# Altium schematic sheet Fusion.SchDoc
size A2
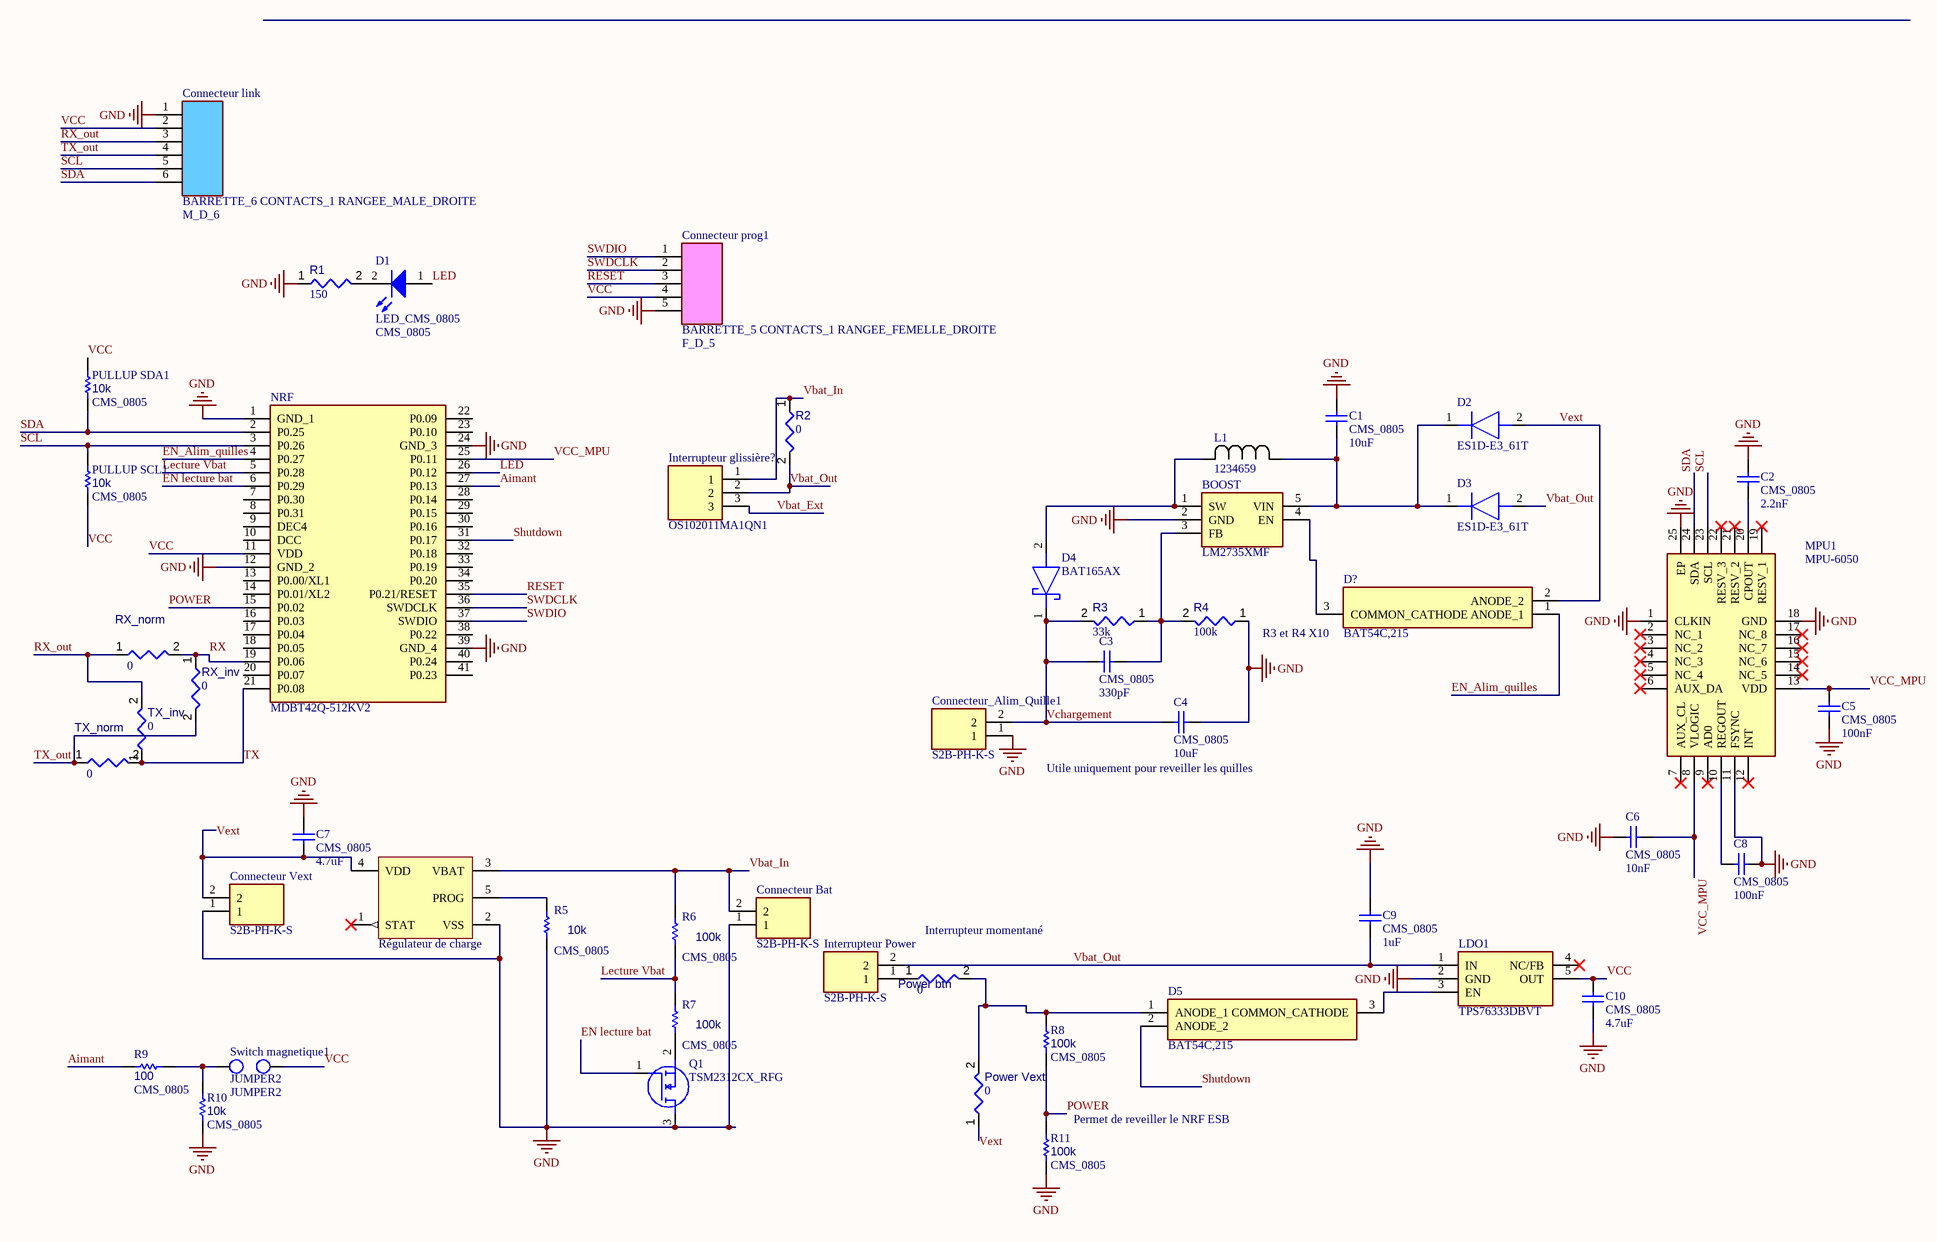
[diagram p0: Fusion.SchDoc]

## Parts
BOOST  LM2735XMF  [SOT95P285X110-5N]
C1  value 10uF  Type: CMS_0805  [CONDENSATEUR_CMS_0805]  (hidden comment: CONDENSATEUR_CMS_CER_0805)
C2  value 2.2nF  Type: CMS_0805  [CONDENSATEUR_CMS_0805]  (hidden comment: CONDENSATEUR_CMS_CER_0805)
C3  value 330pF  Type: CMS_0805  [CONDENSATEUR_CMS_0805]  (hidden comment: CONDENSATEUR_CMS_CER_0805)
C4  value 10uF  Type: CMS_0805  [CONDENSATEUR_CMS_0805]  (hidden comment: CONDENSATEUR_CMS_CER_0805)
C5  value 100nF  Type: CMS_0805  [CONDENSATEUR_CMS_0805]  (hidden comment: CONDENSATEUR_CMS_CER_0805)
C6  value 10nF  Type: CMS_0805  [CONDENSATEUR_CMS_0805]  (hidden comment: CONDENSATEUR_CMS_CER_0805)
C7  value 4.7uF  Type: CMS_0805  [CONDENSATEUR_CMS_0805]  (hidden comment: CONDENSATEUR_CMS_CER_0805)
C8  value 100nF  Type: CMS_0805  [CONDENSATEUR_CMS_0805]  (hidden comment: CONDENSATEUR_CMS_CER_0805)
C9  value 1uF  Type: CMS_0805  [CONDENSATEUR_CMS_0805]  (hidden comment: CONDENSATEUR_CMS_CER_0805)
C10  value 4.7uF  Type: CMS_0805  [CONDENSATEUR_CMS_0805]  (hidden comment: CONDENSATEUR_CMS_CER_0805)
Connecteur_Alim_Quille1  S2B-PH-K-S  [S2BPHKS]
Connecteur_Bat  S2B-PH-K-S  [S2BPHKS]
Connecteur_link  BARRETTE_6 CONTACTS_1 RANGEE_MALE_DROITE  Type: M_D_6  [BARRETTE_6_M_D]
Connecteur_prog1  BARRETTE_5 CONTACTS_1 RANGEE_FEMELLE_DROITE  Type: F_D_5  [BARRETTE_5_F_D]
Connecteur_Vext  S2B-PH-K-S  [S2BPHKS]
D1  LED_CMS_0805  Type: CMS_0805  [LED_CMS_0805]
D2  ES1D-E3_61T  [DIOM5127X229N]
D3  ES1D-E3_61T  [DIOM5127X229N]
D4  BAT165AX  [BAT165AX]
D5  BAT54C,215  [BAT54C215]
D?  BAT54C,215  [BAT54C215]
Interrupteur_glissière?  OS102011MA1QN1  [OS102011MA1QN1]
Interrupteur_Power  S2B-PH-K-S  [S2BPHKS]
L1  1234659  [IND_123_4659_RSP]
LDO1  TPS76333DBVT  [SOT95P280X145-5N]
MPU1  MPU-6050  [MPU6050]
NRF  MDBT42Q-512KV2  [MDBT42Q512KV2]
Power_btn  value 0  [RESC1608X55X25ML10T15]  (hidden comment: Resistor 4k7 +/-1% 0603 100 mW)
Power_Vext  value 0  [RESC1608X55X25ML10T15]  (hidden comment: Resistor 4k7 +/-1% 0603 100 mW)
PULLUP_SCL1  value 10k  Type: CMS_0805  [RESISTANCE_CMS_0805]  (hidden comment: RESISTANCE_CMS_0805)
PULLUP_SDA1  value 10k  Type: CMS_0805  [RESISTANCE_CMS_0805]  (hidden comment: RESISTANCE_CMS_0805)
Q1  TSM2312CX_RFG  [SOT95P280X130-3N]
R1  value 150  [RESC0805(2012)_L]  (hidden comment: Resistor 1K +/-5% 0805 125 mW)
R2  value 0  [RESC1608X55X25ML10T15]  (hidden comment: Resistor 4k7 +/-1% 0603 100 mW)
R3  value 33k  [RESC2013X50X35ML15T15]  (hidden comment: Resistor 10k +/-1% 0805 125 mW)
R4  value 100k  [RESC2013X50X35ML15T15]  (hidden comment: Resistor 10k +/-1% 0805 125 mW)
R5  value 10k  Type: CMS_0805  [RESISTANCE_CMS_0805]  (hidden comment: RESISTANCE_CMS_0805)
R6  value 100k  Type: CMS_0805  [RESISTANCE_CMS_0805]  (hidden comment: RESISTANCE_CMS_0805)
R7  value 100k  Type: CMS_0805  [RESISTANCE_CMS_0805]  (hidden comment: RESISTANCE_CMS_0805)
R8  value 100k  Type: CMS_0805  [RESISTANCE_CMS_0805]  (hidden comment: RESISTANCE_CMS_0805)
R9  value 100  Type: CMS_0805  [RESISTANCE_CMS_0805]  (hidden comment: RESISTANCE_CMS_0805)
R10  value 10k  Type: CMS_0805  [RESISTANCE_CMS_0805]  (hidden comment: RESISTANCE_CMS_0805)
R11  value 100k  Type: CMS_0805  [RESISTANCE_CMS_0805]  (hidden comment: RESISTANCE_CMS_0805)
RX_inv  value 0  [RESC1608X55X25ML10T15]  (hidden comment: Resistor 4k7 +/-1% 0603 100 mW)
RX_norm  value 0  [RESC1608X55X25ML10T15]  (hidden comment: Resistor 4k7 +/-1% 0603 100 mW)
Régulateur_de_charge  MCP73831T-2DCI/OT  [SOT-23-OT5_N]  (value not drawn)
Switch_magnetique1  JUMPER2  [BARRETTE_2_M_D]
TX_inv  value 0  [RESC1608X55X25ML10T15]  (hidden comment: Resistor 4k7 +/-1% 0603 100 mW)
TX_norm  value 0  [RESC1608X55X25ML10T15]  (hidden comment: Resistor 4k7 +/-1% 0603 100 mW)

## Nets
GND: BOOST.2(GND) C1.2 C2.2 C4.2 C5.1 C6.1 C7.2 C8.2 C9.2 C10.1 Connecteur_Alim_Quille1.1 Connecteur_Bat.1 Connecteur_link.1 Connecteur_prog1.5 Connecteur_Vext.1 LDO1.2(GND) MPU1.1(CLKIN) MPU1.11(FSYNC) MPU1.18(GND) MPU1.25(EP) NRF.1(GND_1) NRF.12(GND_2) NRF.24(GND_3) NRF.39(GND_4) Q1.3(D) R1.1 R4.1 R5.1 R10.2 R11.1 Régulateur_de_charge.2(VSS)
Aimant: NRF.27(P0.13) R9.1
EN lecture bat: NRF.6(P0.29) Q1.1(G)
EN_Alim_quilles: D?.1(ANODE_1) NRF.4(P0.27)
Lecture Vbat: NRF.5(P0.28) R6.1 R7.2
LED: D1.1 NRF.26(P0.12)
POWER: NRF.15(P0.02) R8.1 R11.2
RESET: Connecteur_prog1.3 NRF.35(P0.21/RESET)
RX: NRF.19(P0.06) RX_inv.1 RX_norm.2
RX_out: Connecteur_link.3 RX_norm.1 TX_inv.2
SCL: Connecteur_link.5 MPU1.23(SCL) NRF.3(P0.26) PULLUP_SCL1.2
SDA: Connecteur_link.6 MPU1.24(SDA) NRF.2(P0.25) PULLUP_SDA1.1
Shutdown: D5.2(ANODE_2) NRF.31(P0.17)
SWDCLK: Connecteur_prog1.2 NRF.36(SWDCLK)
SWDIO: Connecteur_prog1.1 NRF.37(SWDIO)
TX: NRF.21(P0.08) TX_inv.1 TX_norm.2
TX_out: Connecteur_link.4 RX_inv.2 TX_norm.1
Vbat_Ext: Interrupteur_glissière?.3
Vbat_In: Connecteur_Bat.2 Interrupteur_glissière?.1 R2.1 R6.2 Régulateur_de_charge.3(VBAT)
Vbat_Out: C9.1 D3.2(A) Interrupteur_glissière?.2 Interrupteur_Power.2 LDO1.1(IN) R2.2
VCC: C10.2 Connecteur_link.2 Connecteur_prog1.4 LDO1.5(OUT) NRF.11(VDD) PULLUP_SCL1.1 PULLUP_SDA1.2 Switch_magnetique1.2
VCC_MPU: C5.2 C6.2 MPU1.8(VLOGIC) MPU1.13(VDD) NRF.25(P0.11)
Vchargement: C3.1 C4.1 Connecteur_Alim_Quille1.2 D4.1(K) R3.2
Vext: C7.1 Connecteur_Vext.2 D2.2(A) D?.2(ANODE_2) Power_Vext.1 Régulateur_de_charge.4(VDD)
NetBOOST_1: BOOST.1(SW) D4.2(A) L1.2
NetBOOST_3: BOOST.3(FB) C3.2 R3.1 R4.2
NetBOOST_4: BOOST.4(EN) D?.3(COMMON_CATHODE)
NetBOOST_5: BOOST.5(VIN) C1.1 D2.1(K) D3.1(K) L1.1
NetC2_1: C2.1 MPU1.20(CPOUT)
NetC8_1: C8.1 MPU1.10(REGOUT)
NetD1_2: D1.2 R1.2
NetD5_1: D5.1(ANODE_1) Power_btn.2 Power_Vext.2 R8.2
NetD5_3: D5.3(COMMON_CATHODE) LDO1.3(EN)
NetInterrupteur_Power_1: Interrupteur_Power.1 Power_btn.1
NetQ1_2: Q1.2(S) R7.1
NetR5_2: R5.2 Régulateur_de_charge.5(PROG)
NetR9_2: R9.2 R10.1 Switch_magnetique1.1

Not connected (* = marked no-connect by the designer): LDO1 4(NC/FB)*; MPU1 2(NC_1)* 3(NC_2)* 4(NC_3)* 5(NC_4)* 6(AUX_DA)* 7(AUX_CL)* 9(AD0)* 12(INT)* 14(NC_5)* 15(NC_6)* 16(NC_7)* 17(NC_8)* 19(RESV_1)* 21(RESV_2)* 22(RESV_3)*; NRF 7(P0.30) 8(P0.31) 9(DEC4) 10(DCC) 13(P0.00/XL1) 14(P0.01/XL2) 16(P0.03) 17(P0.04) 18(P0.05) 20(P0.07) 22(P0.09) 23(P0.10) 28(P0.14) 29(P0.15) 30(P0.16) 32(P0.18) 33(P0.19) 34(P0.20) 38(P0.22) 40(P0.24) 41(P0.23); Régulateur_de_charge 1(STAT)*

## Notes on the sheet
- (near D?) R3 et R4 X10
- (near C4) Utile uniquement pour reveiller les quilles
- Interrupteur momentané
- (near R11) Permet de reveiller le NRF ESB

## Library data of the parts
BOOST = LM2735XMF: Integrated Circuit; Manufacturer_Name: Texas Instruments; Manufacturer_Part_Number: LM2735XMF
C1-C10 = CMP-038-0003-1: CONDENSATEUR CMS CERAMIQUE 0805; Source: composants passifs.SchLib; Design Item ID: CONDENSATEUR_CMS_CER_0805
Connecteur_Alim_Quille1 Connecteur_Bat Connecteur_Vext Interrupteur_Power = S2B-PH-K-S: Connector; Manufacturer_Name: JST (JAPAN SOLDERLESS TERMINALS); Datasheet Link: https://media.digikey.com/pdf/Data%20Sheets/JST%20PDFs/PH%20Series.pdf; Height: 4.8mm; Manufacturer_Part_Number: S2B-PH-K-S
Connecteur_link = CMP-039-0125-1: BARRETTE 6 CONTACTS 1 RANGEE MALE DROITE; Source: connecteurs.SchLib; Design Item ID: BARRETTE_6 CONTACTS_1 RANGEE_MALE_DROITE
Connecteur_prog1 = CMP-039-0118-1: BARRETTE 5 CONTACTS 1 RANGEE FEMELLE DROITE; Design Item ID: BARRETTE_5 CONTACTS_1 RANGEE_FEMELLE_DROITE; Source: connecteurs.SchLib
D1 = CMP-024-0003-1: LED CMS 0805; Source: affichage.SchLib; Design Item ID: LED_CMS_0805
D2 D3 = ES1D-E3_61T: Diode; Manufacturer_Name: Vishay; Manufacturer_Part_Number: ES1D-E3/61T; Datasheet Link: https://componentsearchengine.com/Datasheets/2/ES1D-E3_61T.pdf; Height: 2.29mm; Mouser Part Number: 625-ES1D-E3; Mouser Price/Stock: https://www.mouser.co.uk/ProductDetail/Vishay-General-Semiconductor/ES1D-E3-61T?qs=rfh7uIuiIO0XwaKoN5aNdQ%3D%3D; Arrow Part Number: ES1D-E3/61T; Arrow Price/Stock: https://www.arrow.com/en/products/es1d-e361t/vishay
D4 = BAT165AX: Schottky Diode; Manufacturer_Name: Nexperia; Datasheet Link: https://assets.nexperia.com/documents/data-sheet/BAT165A.pdf; Height: 1.1mm; Manufacturer_Part_Number: BAT165AX; Mouser Part Number: 771-BAT165AX; Mouser Price/Stock: https://www.mouser.co.uk/ProductDetail/Nexperia/BAT165AX?qs=1fQ7IOp4WriMQ9TlJoQ5jw%3D%3D; Arrow Part Number: BAT165AX; Arrow Price/Stock: https://www.arrow.com/en/products/bat165ax/nexperia?region=nac
D5 D? = BAT54C,215: Schottky Diode; Manufacturer_Name: Nexperia; Datasheet Link: https://assets.nexperia.com/documents/data-sheet/BAT54_SER.pdf; Height: 1.1mm; Manufacturer_Part_Number: BAT54C,215; Mouser Part Number: 771-BAT54C-T/R; Mouser Price/Stock: https://www.mouser.co.uk/ProductDetail/Nexperia/BAT54C215?qs=me8TqzrmIYV5SKKt13YKQA%3D%3D; Arrow Part Number: BAT54C,215; Arrow Price/Stock: https://www.arrow.com/en/products/bat54c215/nexperia?region=nac
Interrupteur_glissière? = OS102011MA1QN1: Switch; Manufacturer_Name: C & K COMPONENTS; Datasheet Link: http://www.ckswitches.com/media/1428/os.pdf; Manufacturer_Part_Number: OS102011MA1QN1; Mouser Part Number: 611-OS102011MA1QN1; Mouser Price/Stock: https://www.mouser.co.uk/ProductDetail/CK/OS102011MA1QN1?qs=WtljUlYws5R6MUgHcLkz4w%3D%3D; Arrow Part Number: OS102011MA1QN1; Arrow Price/Stock: https://www.arrow.com/en/products/os102011ma1qn1/ck?region=europe
L1 = 1234659: No Description Available; Mfr_Name: RS Pro; Type: DEV; Copyright: Copyright (C) 2022 Ultra Librarian. All rights reserved.; Manufacturer_Part_Number: 1234659; RefDes: RefDes
LDO1 = TPS76333DBVT: Integrated Circuit; Manufacturer_Name: Texas Instruments; Datasheet Link: https://datasheet.datasheetarchive.com/originals/distributors/Datasheets-36/DSA-717371.pdf; Height: 1.45mm; Manufacturer_Part_Number: TPS76333DBVT; Mouser Part Number: 595-TPS76333DBVT; Mouser Price/Stock: https://www.mouser.co.uk/ProductDetail/Texas-Instruments/TPS76333DBVT?qs=tJ5HNKWh3OU6kt%2FvF%2F5hDQ%3D%3D; Arrow Part Number: TPS76333DBVT; Arrow Price/Stock: https://www.arrow.com/en/products/tps76333dbvt/texas-instruments?region=nac
MPU1 = MPU-6050: Integrated Circuit; Manufacturer_Name: TDK; Datasheet Link: https://product.tdk.com/system/files/dam/doc/product/sensor/mortion-inertial/imu/data_sheet/mpu-6000-datasheet1.pdf; Height: 0.95mm; Manufacturer_Part_Number: MPU-6050; Mouser Part Number: 410-MPU-6050; Mouser Price/Stock: https://www.mouser.co.uk/ProductDetail/TDK-InvenSense/MPU-6050?qs=u4fy%2FsgLU9O14B5JgyQFvg%3D%3D; Arrow Part Number: MPU-6050; Arrow Price/Stock: https://www.arrow.com/en/products/mpu-6050/invensense?region=nac
NRF = MDBT42Q-512KV2: Integrated Circuit; Manufacturer_Name: Raytac; Datasheet Link: http://www.raytac.com/download/index.php?index_id=27; Height: 2.2mm; Manufacturer_Part_Number: MDBT42Q-512KV2
Power_btn Power_Vext R2 RX_inv RX_norm TX_inv TX_norm = CMP-009-00031-5: Chip Resistor, 4.7 KOhm, +/- 1%, 0.1 W, -55 to 155 degC, 0603 (1608 Metric); Power: 100mW; Tolerance: 1%; Mounting Technology: SM; Case/Package: 0603; RoHS Compliant: True; Pins: 2; Min Operating Temperature: -55°C; Max Operating Temperature: 155°C
PULLUP_SCL1 PULLUP_SDA1 R5-R11 = CMP-037-0001-1: RESISTANCE CMS 0805; Design Item ID: RESISTANCE_CMS_0805; Source: composants passifs.SchLib
Q1 = TSM2312CX_RFG: MOSFET (N-Channel); Manufacturer_Name: Taiwan Semiconductor; Manufacturer_Part_Number: TSM2312CX RFG; Datasheet Link: https://datasheet.datasheetarchive.com/originals/distributors/DKDS-20/389616.pdf; Height: 1.3mm; Mouser Part Number: 821-TSM2312CXRFG; Mouser Price/Stock: https://www.mouser.co.uk/ProductDetail/Taiwan-Semiconductor/TSM2312CX-RFG?qs=QEzMiVqgwc0lDLiJAqaF%252Bw%3D%3D; Arrow Part Number: TSM2312CX RFG; Arrow Price/Stock: https://www.arrow.com/en/products/tsm2312cxrfg/taiwan-semiconductor?region=asia
R1 = CMP-009-00118-3: Chip Resistor, 1 kOhms, +/-5%, 125 mW, -55 to 155 degC, 0805; Tolerance: 5%; Power: 125mW; Case/Package: 0805; Pins: 2; Min Operating Temperature: -55°C; Max Operating Temperature: 155°C
R3 R4 = CMP-009-00018-5: Chip Resistor, 10 KOhm, +/- 1%, 125 mW, -55 to 155 degC, 0805 (2012 Metric); Power: 125mW; Voltage Rating: 150V; Tolerance: 1%; Pins: 2; Min Operating Temperature: -55°C; Case/Package: 0805; Max Operating Temperature: 155°C; RoHS Compliant: True; Mounting Technology: SM
Régulateur_de_charge = CMP-045-0000-1: Miniature Single-Cell, Fully Integrated Li-Ion, Li-Polymer Charge Management Controller, 4.2V, 5-Pin SOT-23, Industrial Temperature, Tape and Reel; Manufacturer: Microchip; PackageReference: SOT-23-OT5; Code_IPC: SOT23-5; Source: energie.SchLib; PartNumber: MCP73831T-2DCI/OT; PackageVersion: revBB, Aug-2009; Design Item ID: MCP73831T-2DCI/OT; Mounting Technology: Surface Mount; PackageDescription: 5-Lead Plastic Small Outline Transistor (OT) [SOT-23]; ComponentLink1URL: http://www.microchip.com/; ComponentLink1Description: Manufacturer URL; ComponentLink3Description: Package Specification; ComponentLink2Description: Datasheet; DatasheetVersion: revE, Sep-2008; ComponentLink2URL: http://ww1.microchip.com/downloads/en/DeviceDoc/21984e.pdf; ComponentLink3URL: http://www.microchip.com/stellent/groups/techpub_sg/documents/packagingspec/en012702.pdf
Switch_magnetique1 = CMP-039-0004-1: BARRETTE 2 CONTACTS 1 RANGEE MALE DROITE; Type: JUMPER2; Design Item ID: JUMPER2; Source: connecteurs.SchLib